# Altium project pk2socket.PrjPcb
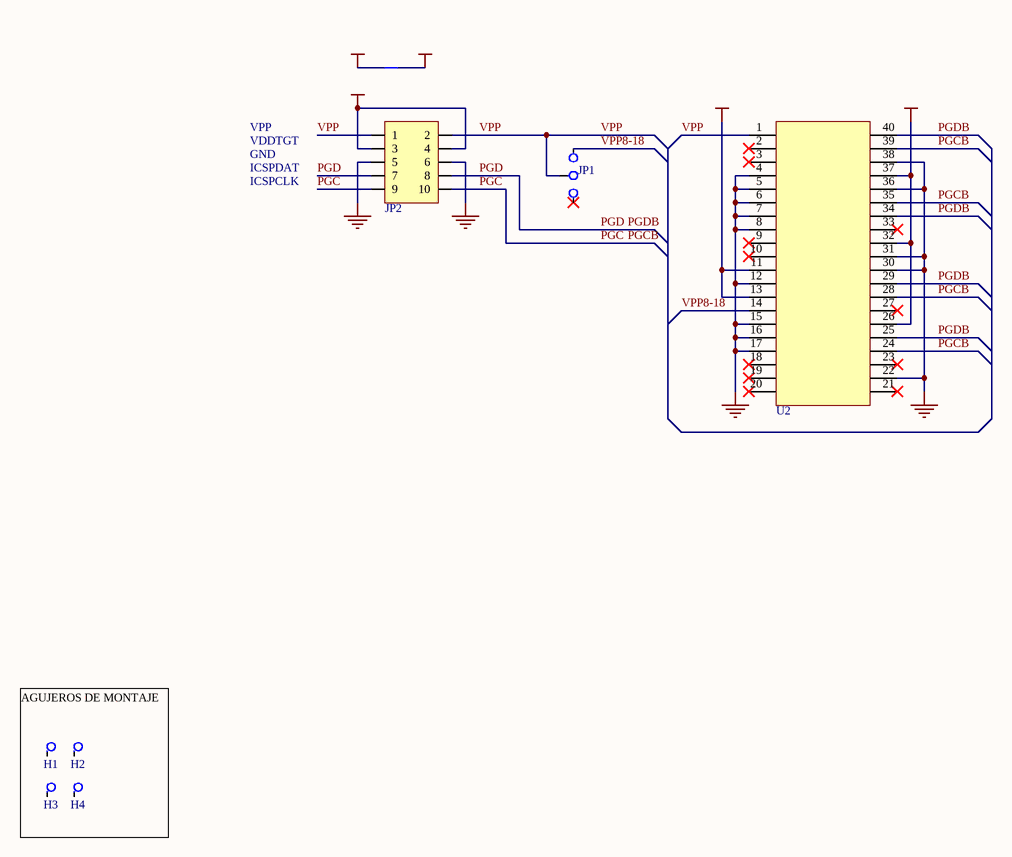
[diagram p0: pk2socket.SchDoc]
1 sheet, 8 parts. Net scope: global (net labels, ports and power ports of the same name join across sheets).
Board file: pk2socket.PcbDoc

## Sheet pk2socket.SchDoc
size A4

### Parts
H1  Agujero de montaje  [agujero]  (value not drawn)
H2  Agujero de montaje  [agujero]  (value not drawn)
H3  Agujero de montaje  [agujero]  (value not drawn)
H4  Agujero de montaje  [agujero]  (value not drawn)
JP1  JP2  [hdr3x1]  (value not drawn)
JP2  Header5x1  [IDC5x2]  (value not drawn)
U2  SOCKET DIP40  [zif40]  (value not drawn)
W9  CABLE  [1206NP]  (value not drawn)

### Nets
GND: JP2.5 JP2.6 U2.4 U2.5 U2.6 U2.7 U2.8 U2.12 U2.15 U2.16 U2.17 U2.22 U2.30 U2.31 U2.36 U2.38
VDDTGT: JP2.3 JP2.4 U2.11 U2.13 W9.1
VDDTGT2: U2.26 U2.32 U2.37 W9.2
PGC: JP2.9 JP2.10 U2.24 U2.28 U2.35 U2.39  [also labelled PGCB]
PGD: JP2.7 JP2.8 U2.25 U2.29 U2.34 U2.40  [also labelled PGDB]
VPP: JP1.2 JP2.1 JP2.2 U2.1
VPP8-18: JP1.3 U2.14

Not connected (* = marked no-connect by the designer): H1 1; H2 1; H3 1; H4 1; JP1 1*; U2 2* 3* 9* 10* 18* 19* 20* 21* 23* 27* 33*

### Notes on the sheet
- VPP
- VDDTGT
- GND
- ICSPDAT
- ICSPCLK
- AGUJEROS DE MONTAJE

### Library data of the parts
JP1 = JP2: Jumper 3 contactos; Price: ?
JP2 = Header5x2: Header 5x2; Price: ?
U2 = SOCKET DIP40: Price: ?